# EAGLE design ARE_adaptadora_AT90-8515_40pin (EAGLE 6.5.0)
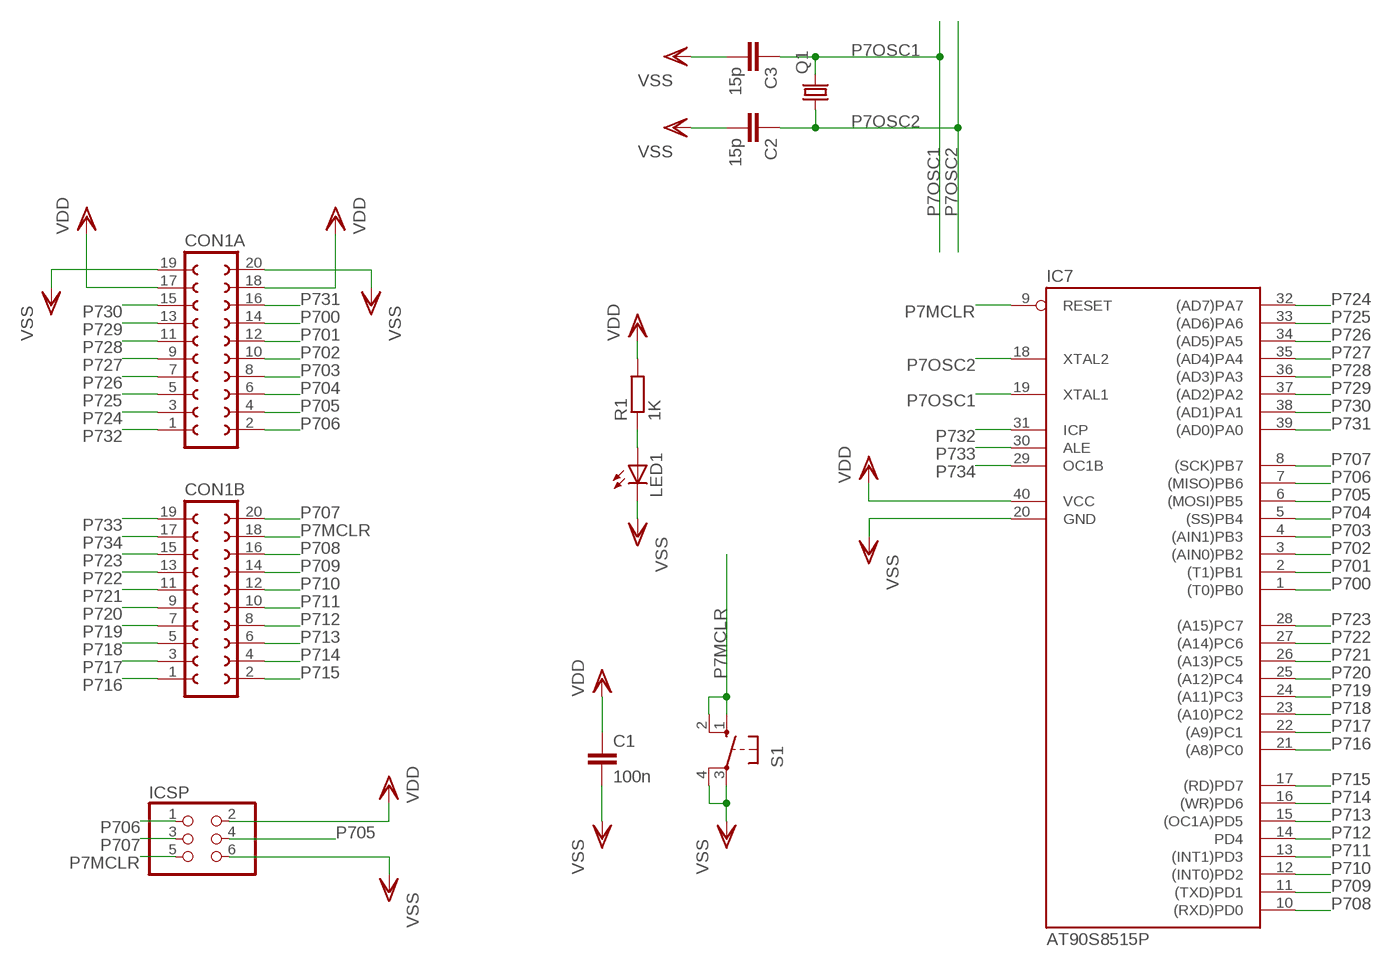
[diagram p0: schematic, sheet 1]

## Parts
C1  100n  C-EUC0805  [C0805]
C2  15p  C-EUC0805  [C0805]
C3  15p  C-EUC0805  [C0805]
CON1A  FE10-2W  [FE10-2W]
CON1B  FE10-2W  [FE10-2W]
IC7  AT90S8515P  [DIL40]
ICSP  PINHD-2X3  [2X03]
LED1  LED3MM  [LED3MM]
Q1  CRYSTALHC18U-V  [HC18U-V]
R1  1K  R-EU_R0805  [R0805]
S1  10-XX  [B3F-10XX]

## Nets
N$7: LED1.A R1.1
P7MCLR: CON1B.18 IC7.9(RESET) ICSP.5 S1.1(S) S1.2(S1)
P7OSC1: C3.1 IC7.19(XTAL1) Q1.2
P7OSC2: C2.1 IC7.18(XTAL2) Q1.1
P700: CON1A.14 IC7.1((T0)PB0)
P701: CON1A.12 IC7.2((T1)PB1)
P702: CON1A.10 IC7.3((AIN0)PB2)
P703: CON1A.8 IC7.4((AIN1)PB3)
P704: CON1A.6 IC7.5((SS)PB4)
P705: CON1A.4 IC7.6((MOSI)PB5) ICSP.4
P706: CON1A.2 IC7.7((MISO)PB6) ICSP.1
P707: CON1B.20 IC7.8((SCK)PB7) ICSP.3
P708: CON1B.16 IC7.10((RXD)PD0)
P709: CON1B.14 IC7.11((TXD)PD1)
P710: CON1B.12 IC7.12((INT0)PD2)
P711: CON1B.10 IC7.13((INT1)PD3)
P712: CON1B.8 IC7.14(PD4)
P713: CON1B.6 IC7.15((OC1A)PD5)
P714: CON1B.4 IC7.16((WR)PD6)
P715: CON1B.2 IC7.17((RD)PD7)
P716: CON1B.1 IC7.21((A8)PC0)
P717: CON1B.3 IC7.22((A9)PC1)
P718: CON1B.5 IC7.23((A10)PC2)
P719: CON1B.7 IC7.24((A11)PC3)
P720: CON1B.9 IC7.25((A12)PC4)
P721: CON1B.11 IC7.26((A13)PC5)
P722: CON1B.13 IC7.27((A14)PC6)
P723: CON1B.15 IC7.28((A15)PC7)
P724: CON1A.3 IC7.32((AD7)PA7)
P725: CON1A.5 IC7.33((AD6)PA6)
P726: CON1A.7 IC7.34((AD5)PA5)
P727: CON1A.9 IC7.35((AD4)PA4)
P728: CON1A.11 IC7.36((AD3)PA3)
P729: CON1A.13 IC7.37((AD2)PA2)
P730: CON1A.15 IC7.38((AD1)PA1)
P731: CON1A.16 IC7.39((AD0)PA0)
P732: CON1A.1 IC7.31(ICP)
P733: CON1B.19 IC7.30(ALE)
P734: CON1B.17 IC7.29(OC1B)
VDD: C1.1 CON1A.17 CON1A.18 IC7.40(VCC) ICSP.2 R1.2
VSS: C1.2 C2.2 C3.2 CON1A.19 CON1A.20 IC7.20(GND) ICSP.6 LED1.K(C) S1.3(P) S1.4(P1)

## Library data of the parts
C1-C3 = rcl:C-EU: CAPACITOR, European symbol
CON1A CON1B = con-lsta:FE10-2W: FEMALE HEADER; OC_FARNELL: unknown; OC_NEWARK: unknown
IC7 = atmel:AT90S8515P: MICROCONTROLLER 8 Kbytes FLASH 512 bytes SRAM 512 bytes EEPROM UART; OC_FARNELL: unknown; OC_NEWARK: unknown
ICSP = pinhead:PINHD-2X3: PIN HEADER
LED1 = SparkFun:LED: LEDs Standard schematic elements and footprints for 5mm, 3mm, 1206, and 0603 sized LEDs. 5mm - Spark Fun Electronics SKU : COM-00529 (and others)
Q1 = crystal:CRYSTAL: CRYSTAL; OC_FARNELL: unknown; OC_NEWARK: unknown
R1 = rcl:R-EU_: RESISTOR, European symbol
S1 = switch-omron:10-XX: OMRON SWITCH; MPN: B3F-1000; OC_FARNELL: 176432; OC_NEWARK: 36M3542

## Board
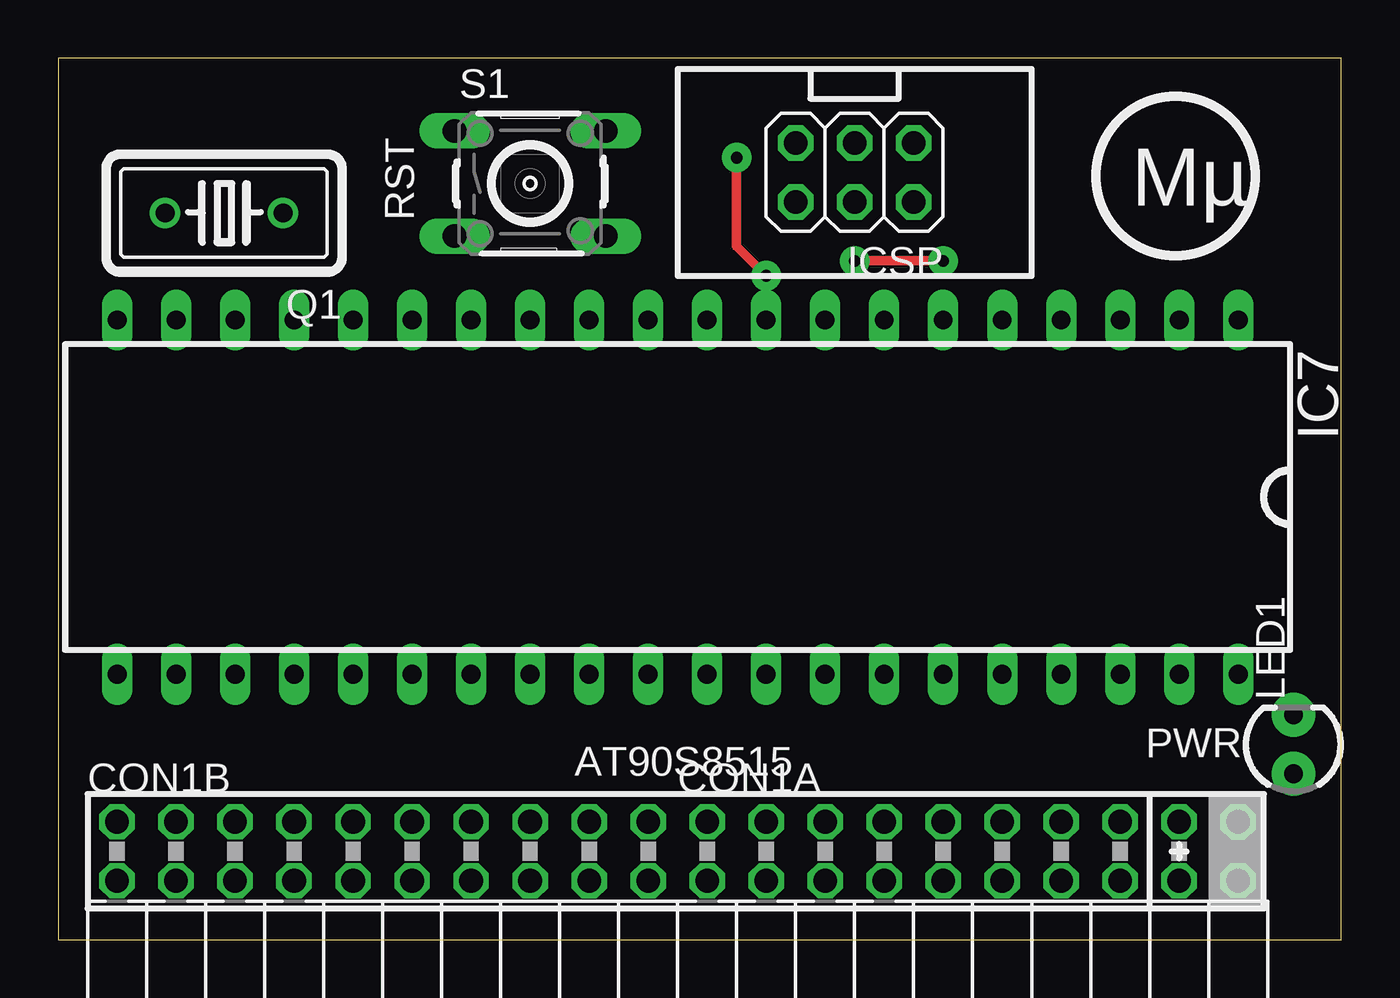
[diagram p1: board, top side]
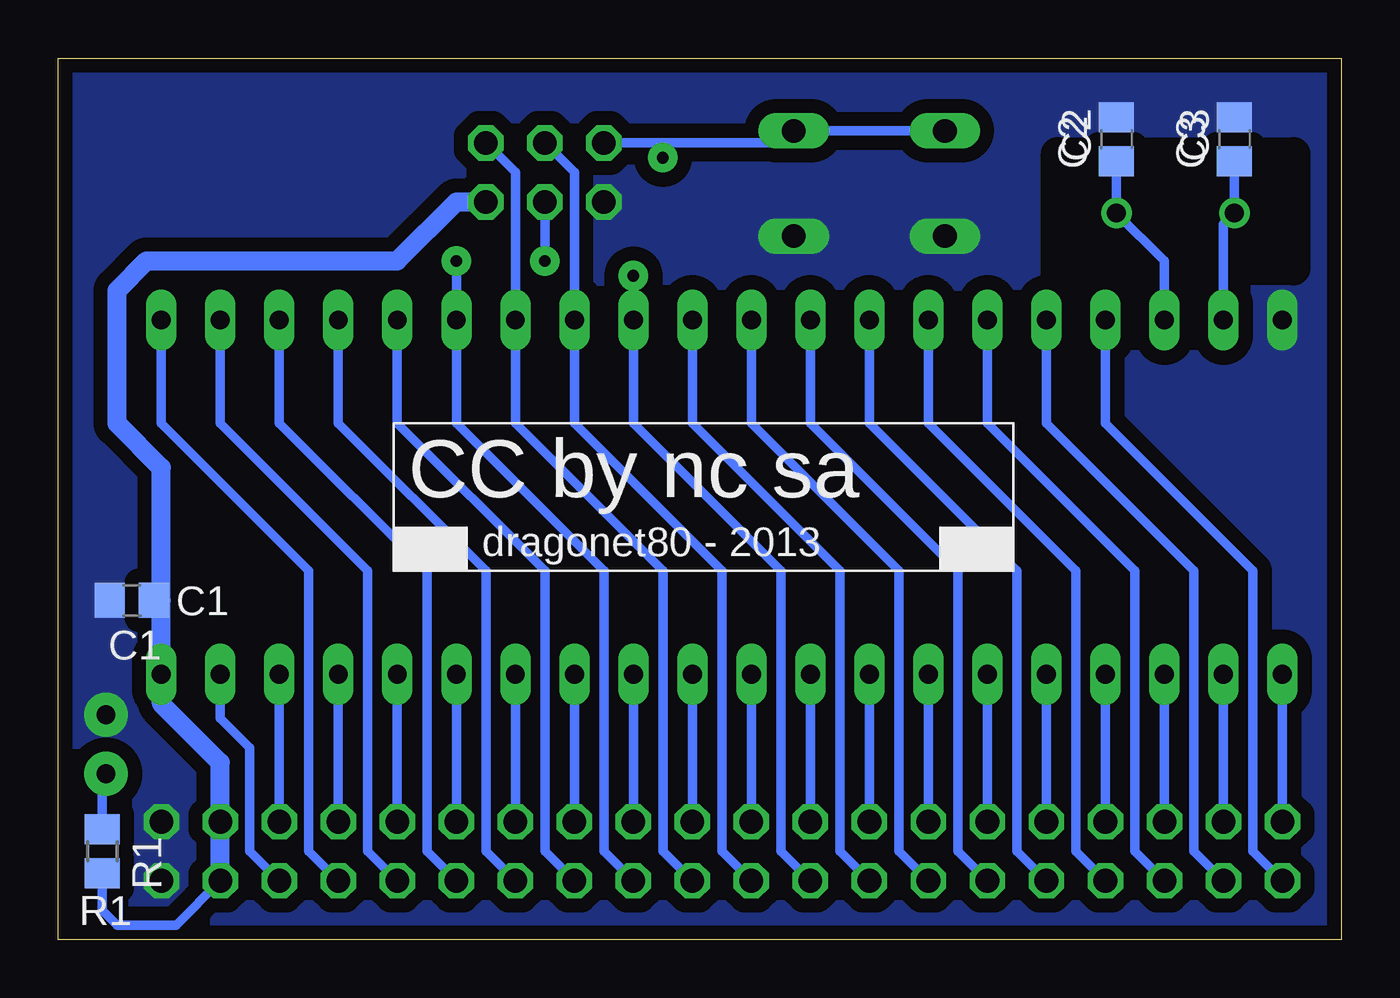
[diagram p2: board, bottom side, seen from below]

Size 55.24 x 37.94 mm. Coordinates in mm from the lower left corner, seen from the top.
Outline: 0,0 55.24,0 55.24,37.94 0,37.94 0,0
Copper layers (1*16): Top 0.035mm / dielectric 1.5mm / Bottom 0.035mm
Design rules "ITEADstudio_DRC": minimum track width 6mil, minimum drill 12mil, track to track 6mil, track to pad 6mil, pad to pad 6mil, via to via 6mil, smd to smd 0mil, copper to edge 10mil, drill to drill 10mil, minimum pad ring 10mil, minimum via ring 6mil, stop-mask expansion 2mil, vias tented up to drill 100mil, thermal gap 10mil
bRestrict: area 2.1,28.9 to 12.2,33.8

### Footprints (pad centres in the part's own frame; a part is rotated, then mirrored left to right if it is on the bottom)
C0805 = smd 1.3 x 1.5: 1 -0.95,0; 2 0.95,0
FE10-2W = drill 1.016 octagon: 1 -11.43,1.27; 2 -11.43,-1.27; 3 -8.89,1.27; 4 -8.89,-1.27; 5 -6.35,1.27; 6 -6.35,-1.27; 7 -3.81,1.27; 8 -3.81,-1.27; 9 -1.27,1.27; 10 -1.27,-1.27; 11 1.27,1.27; 12 1.27,-1.27; 13 3.81,1.27; 14 3.81,-1.27; 15 6.35,1.27; 16 6.35,-1.27; 17 8.89,1.27; 18 8.89,-1.27; 19 11.43,1.27; 20 11.43,-1.27
DIL40 = drill 0.813 long: 1 -24.13,-7.62; 2 -21.59,-7.62; 3 -19.05,-7.62; 4 -16.51,-7.62; 5 -13.97,-7.62; 6 -11.43,-7.62; 7 -8.89,-7.62; 8 -6.35,-7.62; 9 -3.81,-7.62; 10 -1.27,-7.62; 11 1.27,-7.62; 12 3.81,-7.62; 13 6.35,-7.62; 14 8.89,-7.62; 15 11.43,-7.62; 16 13.97,-7.62; 17 16.51,-7.62; 18 19.05,-7.62; 19 21.59,-7.62; 20 24.13,-7.62; 21 24.13,7.62; 22 21.59,7.62; 23 19.05,7.62; 24 16.51,7.62; 25 13.97,7.62; 26 11.43,7.62; 27 8.89,7.62; 28 6.35,7.62; 29 3.81,7.62; 30 1.27,7.62; 31 -1.27,7.62; 32 -3.81,7.62; 33 -6.35,7.62; 34 -8.89,7.62; 35 -11.43,7.62; 36 -13.97,7.62; 37 -16.51,7.62; 38 -19.05,7.62; 39 -21.59,7.62; 40 -24.13,7.62
2X03 = drill 1.016 octagon: 1 -2.54,-1.27; 2 -2.54,1.27; 3 0,-1.27; 4 0,1.27; 5 2.54,-1.27; 6 2.54,1.27
LED3MM = drill 0.813 pad 1.88: A -1.27,0; K 1.27,0
HC18U-V = drill 0.813: 1 -2.54,0; 2 2.54,0
R0805 = smd 1.3 x 1.5: 1 -0.95,0; 2 0.95,0
B3F-10XX = drill 1.016 long: 1 -3.251,2.261; 2 3.251,2.261; 3 -3.251,-2.261; 4 3.251,-2.261

### Placement (x,y rotation side)
C1  52.07,14.61 180 bottom
C2  9.68,34.45 90 bottom
C3  4.6,34.45 90 bottom
CON1A  39.37,3.81 0 top
CON1B  13.97,3.81 0 top
IC7  26.67,19.05 180 top
ICSP  34.29,33.02 180 top
LED1  53.18,8.41 90 top
Q1  7.14,31.27 180 top
R1  53.34,3.81 270 bottom
S1  20.32,32.54 0 top

### Tracks (layer width: path | path; a pad name or v marks a point on that pad's centre or on a via)
N$7
  Bottom 0.406: R1.1 53.34,6.98 LED1.A
P7MCLR  (via drill 0.5 pad 1.27)
  Top 0.406: v30.48,28.58 29.21,29.84 v29.21,33.66
  Bottom 0.406: S1.1 S1.2 24.09,34.29 29.21,34.29 | CON1B.18 24.13,3.81 24.13,15.88 30.48,22.22 IC7.9 v30.48,28.58 | 29.21,34.29 ICSP.5 | v29.21,33.66 29.21,34.29
P7OSC1
  Bottom 0.406: C3.1 Q1.2 5.08,30.8 IC7.19
P7OSC2
  Bottom 0.406: C2.1 Q1.1 7.62,29.21 IC7.18
P700
  Bottom 0.406: IC7.1 50.8,22.22 44.45,15.88 44.45,3.81 CON1A.14
P701
  Bottom 0.406: IC7.2 48.26,22.22 41.91,15.88 41.91,3.81 CON1A.12
P702
  Bottom 0.406: IC7.3 45.72,22.22 39.37,15.88 39.37,3.81 CON1A.10
P703
  Bottom 0.406: IC7.4 43.18,22.22 36.83,15.88 36.83,3.81 CON1A.8
P704
  Bottom 0.406: IC7.5 40.64,22.22 34.29,15.88 34.29,3.81 CON1A.6
P705  (via drill 0.5 pad 1.27)
  Top 0.406: v34.29,29.21 v38.1,29.21
  Bottom 0.406: CON1A.4 31.75,3.81 31.75,15.88 38.1,22.22 IC7.6 v38.1,29.21 | ICSP.4 v34.29,29.21
P706
  Bottom 0.406: CON1A.2 29.21,3.81 29.21,15.88 35.56,22.22 IC7.7 35.56,33.02 ICSP.1
P707
  Bottom 0.406: CON1B.20 26.67,3.81 26.67,15.88 33.02,22.22 IC7.8 33.02,33.02 ICSP.3
P708
  Bottom 0.406: IC7.10 27.94,22.22 21.59,15.88 21.59,3.81 CON1B.16
P709
  Bottom 0.406: IC7.11 25.4,22.22 19.05,15.88 19.05,3.81 CON1B.14
P710
  Bottom 0.406: IC7.12 22.86,22.22 16.51,15.88 16.51,3.81 CON1B.12
P711
  Bottom 0.406: IC7.13 20.32,22.22 13.97,15.88 13.97,3.81 CON1B.10
P712
  Bottom 0.406: IC7.14 17.78,22.22 11.43,15.88 11.43,3.81 CON1B.8
P713
  Bottom 0.406: IC7.15 15.24,22.22 8.89,15.88 8.89,3.81 CON1B.6
P714
  Bottom 0.406: IC7.16 12.7,22.22 6.35,15.88 6.35,3.81 CON1B.4
P715
  Bottom 0.406: IC7.17 10.16,22.22 3.81,15.88 3.81,3.81 CON1B.2
P716
  Bottom 0.406: IC7.21 CON1B.1
P717
  Bottom 0.406: IC7.22 CON1B.3
P718
  Bottom 0.406: IC7.23 CON1B.5
P719
  Bottom 0.406: IC7.24 CON1B.7
P720
  Bottom 0.406: IC7.25 CON1B.9
P721
  Bottom 0.406: IC7.26 CON1B.11
P722
  Bottom 0.406: IC7.27 CON1B.13
P723
  Bottom 0.406: IC7.28 CON1B.15
P724
  Bottom 0.406: IC7.32 CON1A.3
P725
  Bottom 0.406: IC7.33 CON1A.5
P726
  Bottom 0.406: IC7.34 CON1A.7
P727
  Bottom 0.406: IC7.35 CON1A.9
P728
  Bottom 0.406: IC7.36 CON1A.11
P729
  Bottom 0.406: IC7.37 CON1A.13
P730
  Bottom 0.406: IC7.38 CON1A.15
P731
  Bottom 0.406: IC7.39 48.26,9.52 46.99,8.25 46.99,3.81 CON1A.16
P732
  Bottom 0.406: IC7.31 CON1A.1
P733
  Bottom 0.406: IC7.30 CON1B.19
P734
  Bottom 0.406: IC7.29 CON1B.17
VDD
  Bottom 0.406: R1.2 53.34,1.27 52.7,0.64 50.16,0.64 CON1A.18
  Bottom 0.813: CON1A.18 CON1A.17 48.26,7.62 50.8,10.16 IC7.40 50.8,14.61 | 50.8,14.61 50.8,20.32 52.7,22.22 52.7,27.94 51.44,29.21 40.64,29.21 38.1,31.75 ICSP.2 | C1.1 50.8,14.61
VSS
  pour Bottom (isolate 0.61, no thermals): 0,0 55.24,0 55.24,37.94 0,37.94

### Text on the board
_tsilk: Mµ | RST | PWR | AT90S8515
_bsilk: C3 | C2 | CC by nc sa | dragonet80 - 2013 | C1 | R1